# Altium schematic sheet DDR.SchDoc
size A3; SheetNumber: 6; SheetTotal: 8
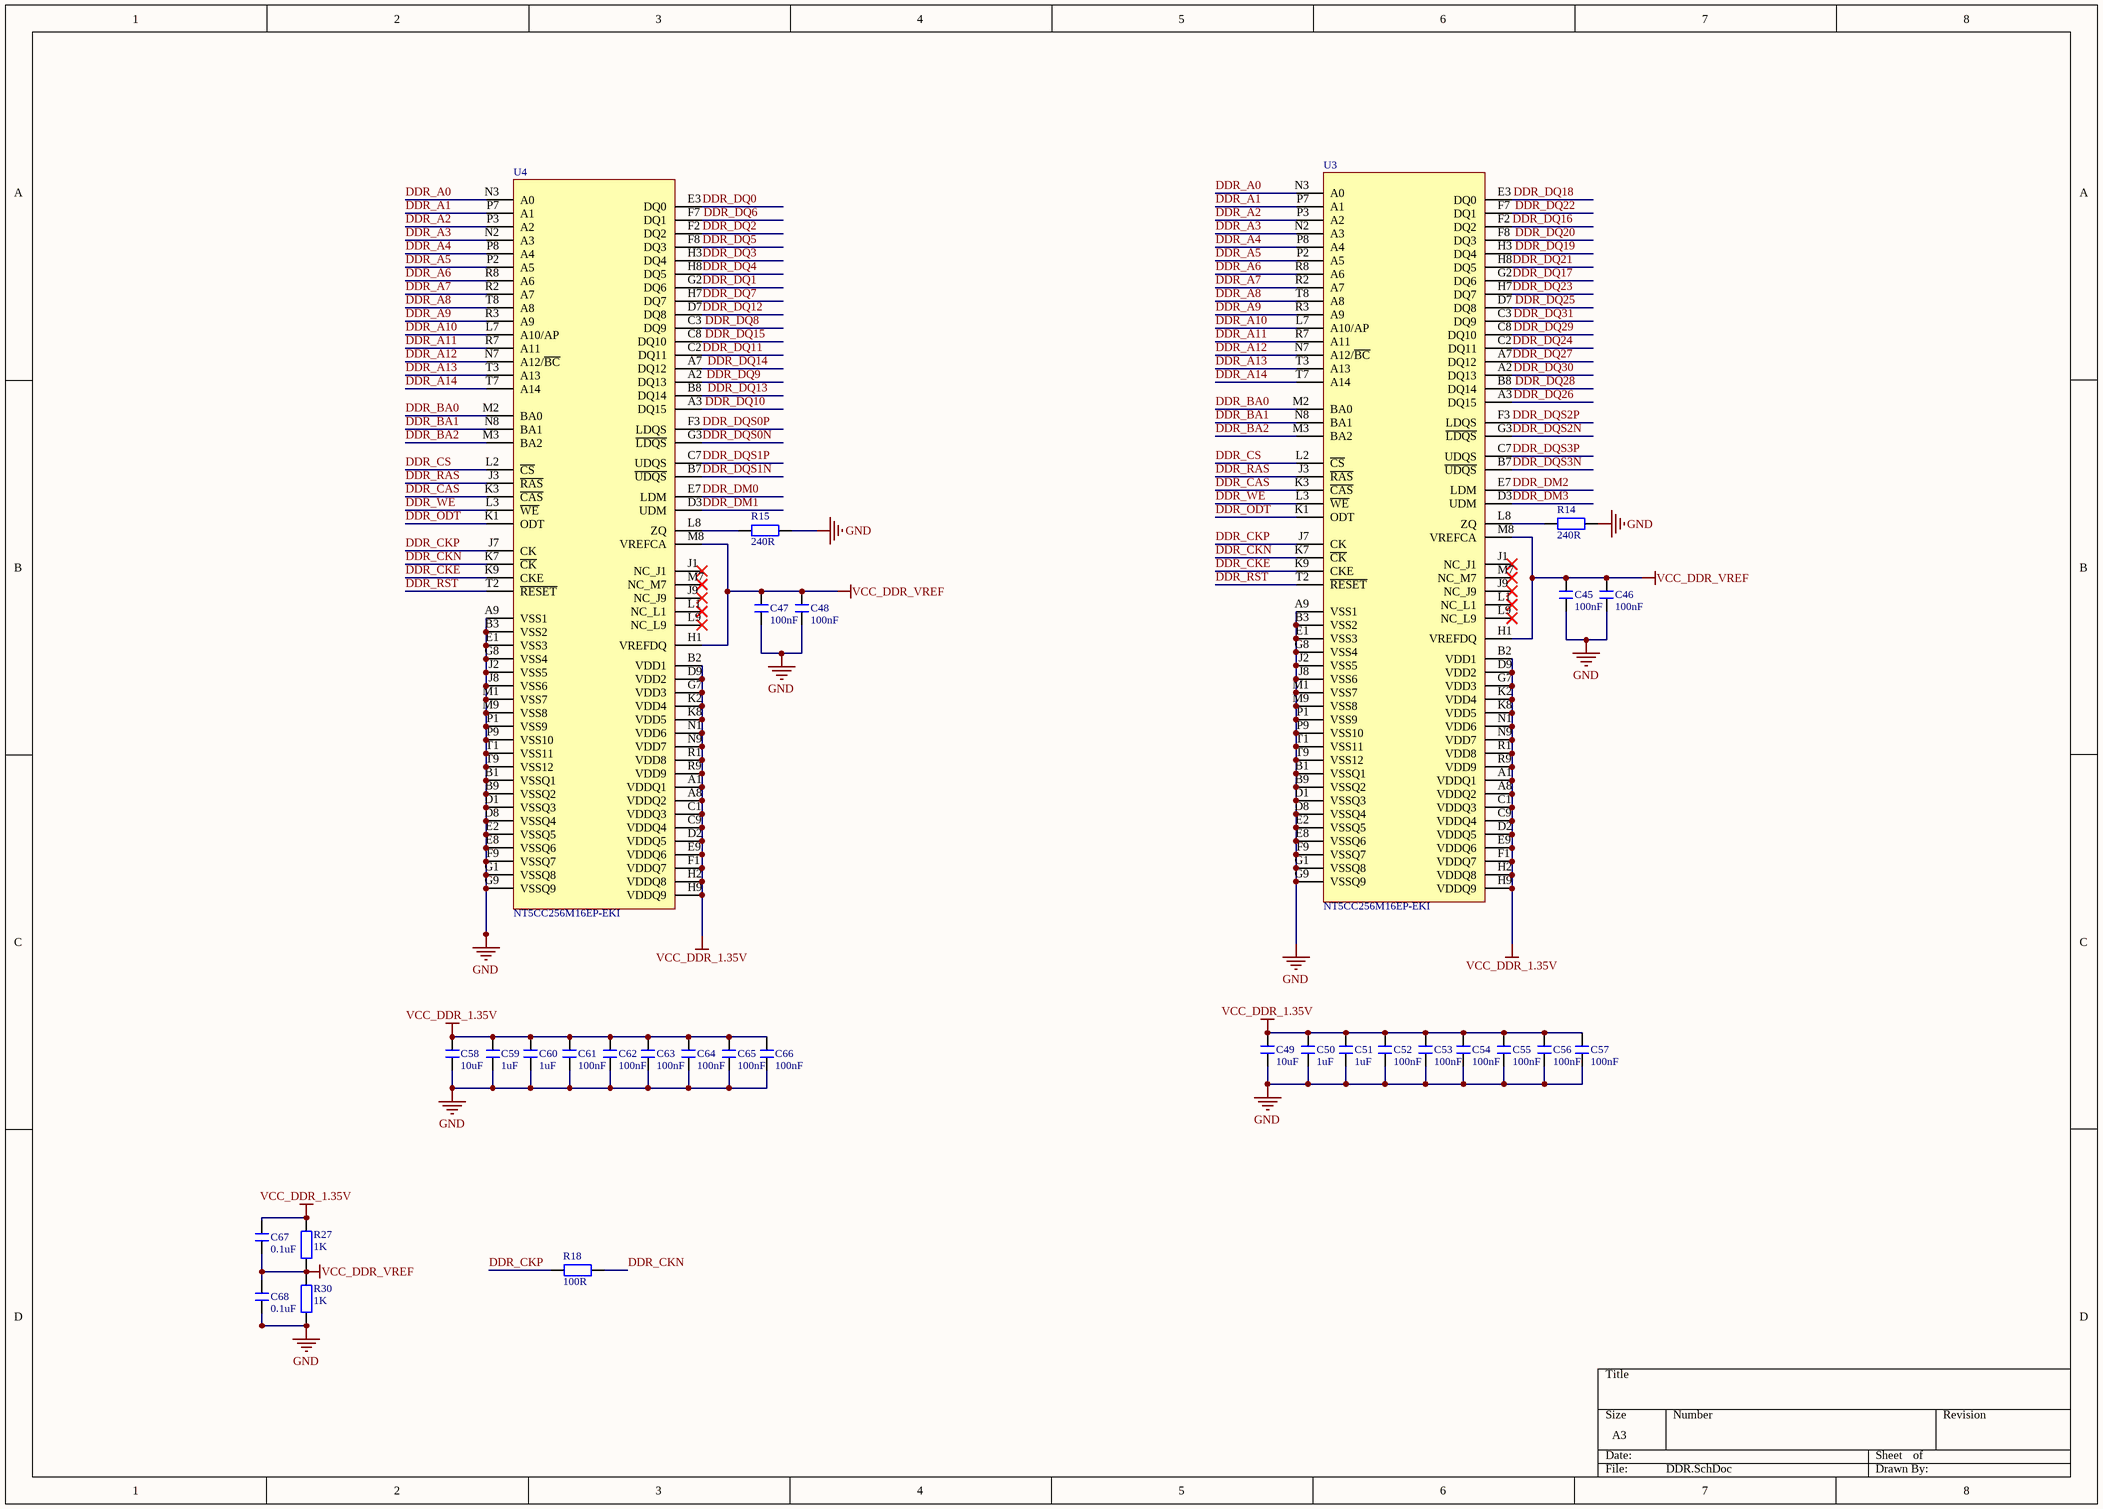
[diagram p0: DDR.SchDoc]

## Parts
C45  100nF  [C 0402]
C46  100nF  [C 0402]
C47  100nF  [C 0402]
C48  100nF  [C 0402]
C49  10uF  [C 0603]
C50  1uF  [C 0402]
C51  1uF  [C 0402]
C52  100nF  [C 0402]
C53  100nF  [C 0402]
C54  100nF  [C 0402]
C55  100nF  [C 0402]
C56  100nF  [C 0402]
C57  100nF  [C 0402]
C58  10uF  [C 0603]
C59  1uF  [C 0402]
C60  1uF  [C 0402]
C61  100nF  [C 0402]
C62  100nF  [C 0402]
C63  100nF  [C 0402]
C64  100nF  [C 0402]
C65  100nF  [C 0402]
C66  100nF  [C 0402]
C67  0.1uF  [C 0402]
C68  0.1uF  [C 0402]
R14  240R  [R 0402]
R15  240R  [R 0402]
R18  100R  [R 0402]
R27  1K  [R 0402]
R30  1K  [R 0402]
U3  NT5CC256M16EP-EKI  [BGA96]
U4  NT5CC256M16EP-EKI  [BGA96]

## Nets
GND: C45.1 C46.1 C47.1 C48.1 C49.1 C50.1 C51.1 C52.1 C53.1 C54.1 C55.1 C56.1 C57.1 C58.1 C59.1 C60.1 C61.1 C62.1 C63.1 C64.1 C65.1 C66.1 C68.1 R14.2 R15.2 R30.1 U3.A9(VSS1) U3.B1(VSSQ1) U3.B3(VSS2) U3.B9(VSSQ2) U3.D1(VSSQ3) U3.D8(VSSQ4) U3.E1(VSS3) U3.E2(VSSQ5) U3.E8(VSSQ6) U3.F9(VSSQ7) U3.G1(VSSQ8) U3.G8(VSS4) U3.G9(VSSQ9) U3.J2(VSS5) U3.J8(VSS6) U3.M1(VSS7) U3.M9(VSS8) U3.P1(VSS9) U3.P9(VSS10) U3.T1(VSS11) U3.T9(VSS12) U4.A9(VSS1) U4.B1(VSSQ1) U4.B3(VSS2) U4.B9(VSSQ2) U4.D1(VSSQ3) U4.D8(VSSQ4) U4.E1(VSS3) U4.E2(VSSQ5) U4.E8(VSSQ6) U4.F9(VSSQ7) U4.G1(VSSQ8) U4.G8(VSS4) U4.G9(VSSQ9) U4.J2(VSS5) U4.J8(VSS6) U4.M1(VSS7) U4.M9(VSS8) U4.P1(VSS9) U4.P9(VSS10) U4.T1(VSS11) U4.T9(VSS12)
VCC_DDR_1.35V: C49.2 C50.2 C51.2 C52.2 C53.2 C54.2 C55.2 C56.2 C57.2 C58.2 C59.2 C60.2 C61.2 C62.2 C63.2 C64.2 C65.2 C66.2 C67.2 R27.2 U3.A1(VDDQ1) U3.A8(VDDQ2) U3.B2(VDD1) U3.C1(VDDQ3) U3.C9(VDDQ4) U3.D2(VDDQ5) U3.D9(VDD2) U3.E9(VDDQ6) U3.F1(VDDQ7) U3.G7(VDD3) U3.H2(VDDQ8) U3.H9(VDDQ9) U3.K2(VDD4) U3.K8(VDD5) U3.N1(VDD6) U3.N9(VDD7) U3.R1(VDD8) U3.R9(VDD9) U4.A1(VDDQ1) U4.A8(VDDQ2) U4.B2(VDD1) U4.C1(VDDQ3) U4.C9(VDDQ4) U4.D2(VDDQ5) U4.D9(VDD2) U4.E9(VDDQ6) U4.F1(VDDQ7) U4.G7(VDD3) U4.H2(VDDQ8) U4.H9(VDDQ9) U4.K2(VDD4) U4.K8(VDD5) U4.N1(VDD6) U4.N9(VDD7) U4.R1(VDD8) U4.R9(VDD9)
VCC_DDR_VREF: C45.2 C46.2 C47.2 C48.2 C67.1 C68.2 R27.1 R30.2 U3.H1(VREFDQ) U3.M8(VREFCA) U4.H1(VREFDQ) U4.M8(VREFCA)
DDR_A0: U3.N3(A0) U4.N3(A0)
DDR_A1: U3.P7(A1) U4.P7(A1)
DDR_A2: U3.P3(A2) U4.P3(A2)
DDR_A3: U3.N2(A3) U4.N2(A3)
DDR_A4: U3.P8(A4) U4.P8(A4)
DDR_A5: U3.P2(A5) U4.P2(A5)
DDR_A6: U3.R8(A6) U4.R8(A6)
DDR_A7: U3.R2(A7) U4.R2(A7)
DDR_A8: U3.T8(A8) U4.T8(A8)
DDR_A9: U3.R3(A9) U4.R3(A9)
DDR_A10: U3.L7(A10/AP) U4.L7(A10/AP)
DDR_A11: U3.R7(A11) U4.R7(A11)
DDR_A12: U3.N7(A12/~{BC}) U4.N7(A12/~{BC})
DDR_A13: U3.T3(A13) U4.T3(A13)
DDR_A14: U3.T7(A14) U4.T7(A14)
DDR_BA0: U3.M2(BA0) U4.M2(BA0)
DDR_BA1: U3.N8(BA1) U4.N8(BA1)
DDR_BA2: U3.M3(BA2) U4.M3(BA2)
DDR_CAS: U3.K3(~{CAS}) U4.K3(~{CAS})
DDR_CKE: U3.K9(CKE) U4.K9(CKE)
DDR_CKN: R18.1 U3.K7(~{CK}) U4.K7(~{CK})
DDR_CKP: R18.2 U3.J7(CK) U4.J7(CK)
DDR_CS: U3.L2(~{CS}) U4.L2(~{CS})
DDR_DM0: U4.E7(LDM)
DDR_DM1: U4.D3(UDM)
DDR_DM2: U3.E7(LDM)
DDR_DM3: U3.D3(UDM)
DDR_DQ0: U4.E3(DQ0)
DDR_DQ1: U4.G2(DQ6)
DDR_DQ2: U4.F2(DQ2)
DDR_DQ3: U4.H3(DQ4)
DDR_DQ4: U4.H8(DQ5)
DDR_DQ5: U4.F8(DQ3)
DDR_DQ6: U4.F7(DQ1)
DDR_DQ7: U4.H7(DQ7)
DDR_DQ8: U4.C3(DQ9)
DDR_DQ9: U4.A2(DQ13)
DDR_DQ10: U4.A3(DQ15)
DDR_DQ11: U4.C2(DQ11)
DDR_DQ12: U4.D7(DQ8)
DDR_DQ13: U4.B8(DQ14)
DDR_DQ14: U4.A7(DQ12)
DDR_DQ15: U4.C8(DQ10)
DDR_DQ16: U3.F2(DQ2)
DDR_DQ17: U3.G2(DQ6)
DDR_DQ18: U3.E3(DQ0)
DDR_DQ19: U3.H3(DQ4)
DDR_DQ20: U3.F8(DQ3)
DDR_DQ21: U3.H8(DQ5)
DDR_DQ22: U3.F7(DQ1)
DDR_DQ23: U3.H7(DQ7)
DDR_DQ24: U3.C2(DQ11)
DDR_DQ25: U3.D7(DQ8)
DDR_DQ26: U3.A3(DQ15)
DDR_DQ27: U3.A7(DQ12)
DDR_DQ28: U3.B8(DQ14)
DDR_DQ29: U3.C8(DQ10)
DDR_DQ30: U3.A2(DQ13)
DDR_DQ31: U3.C3(DQ9)
DDR_DQS0N: U4.G3(~{LDQS})
DDR_DQS0P: U4.F3(LDQS)
DDR_DQS1N: U4.B7(~{UDQS})
DDR_DQS1P: U4.C7(UDQS)
DDR_DQS2N: U3.G3(~{LDQS})
DDR_DQS2P: U3.F3(LDQS)
DDR_DQS3N: U3.B7(~{UDQS})
DDR_DQS3P: U3.C7(UDQS)
DDR_ODT: U3.K1(ODT) U4.K1(ODT)
DDR_RAS: U3.J3(~{RAS}) U4.J3(~{RAS})
DDR_RST: U3.T2(~{RESET}) U4.T2(~{RESET})
DDR_WE: U3.L3(~{WE}) U4.L3(~{WE})
NetR14_1: R14.1 U3.L8(ZQ)
NetR15_1: R15.1 U4.L8(ZQ)

Not connected (* = marked no-connect by the designer): U3 J1(NC_J1)* J9(NC_J9)* L1(NC_L1)* L9(NC_L9)* M7(NC_M7)*; U4 J1(NC_J1)* J9(NC_J9)* L1(NC_L1)* L9(NC_L9)* M7(NC_M7)*

## Library data of the parts
C45-C68 = C: 无极性贴片电容; 版权归属: 正点原子; BOM名称: 无极性贴片电容; 学习资源: www.openedv.com
R14 R15 R18 R27 R30 = R: 贴片电阻; 版权归属: 正点原子; BOM名称: 贴片电阻; 学习资源: www.openedv.com
U3 U4 = MT41K256M16TW